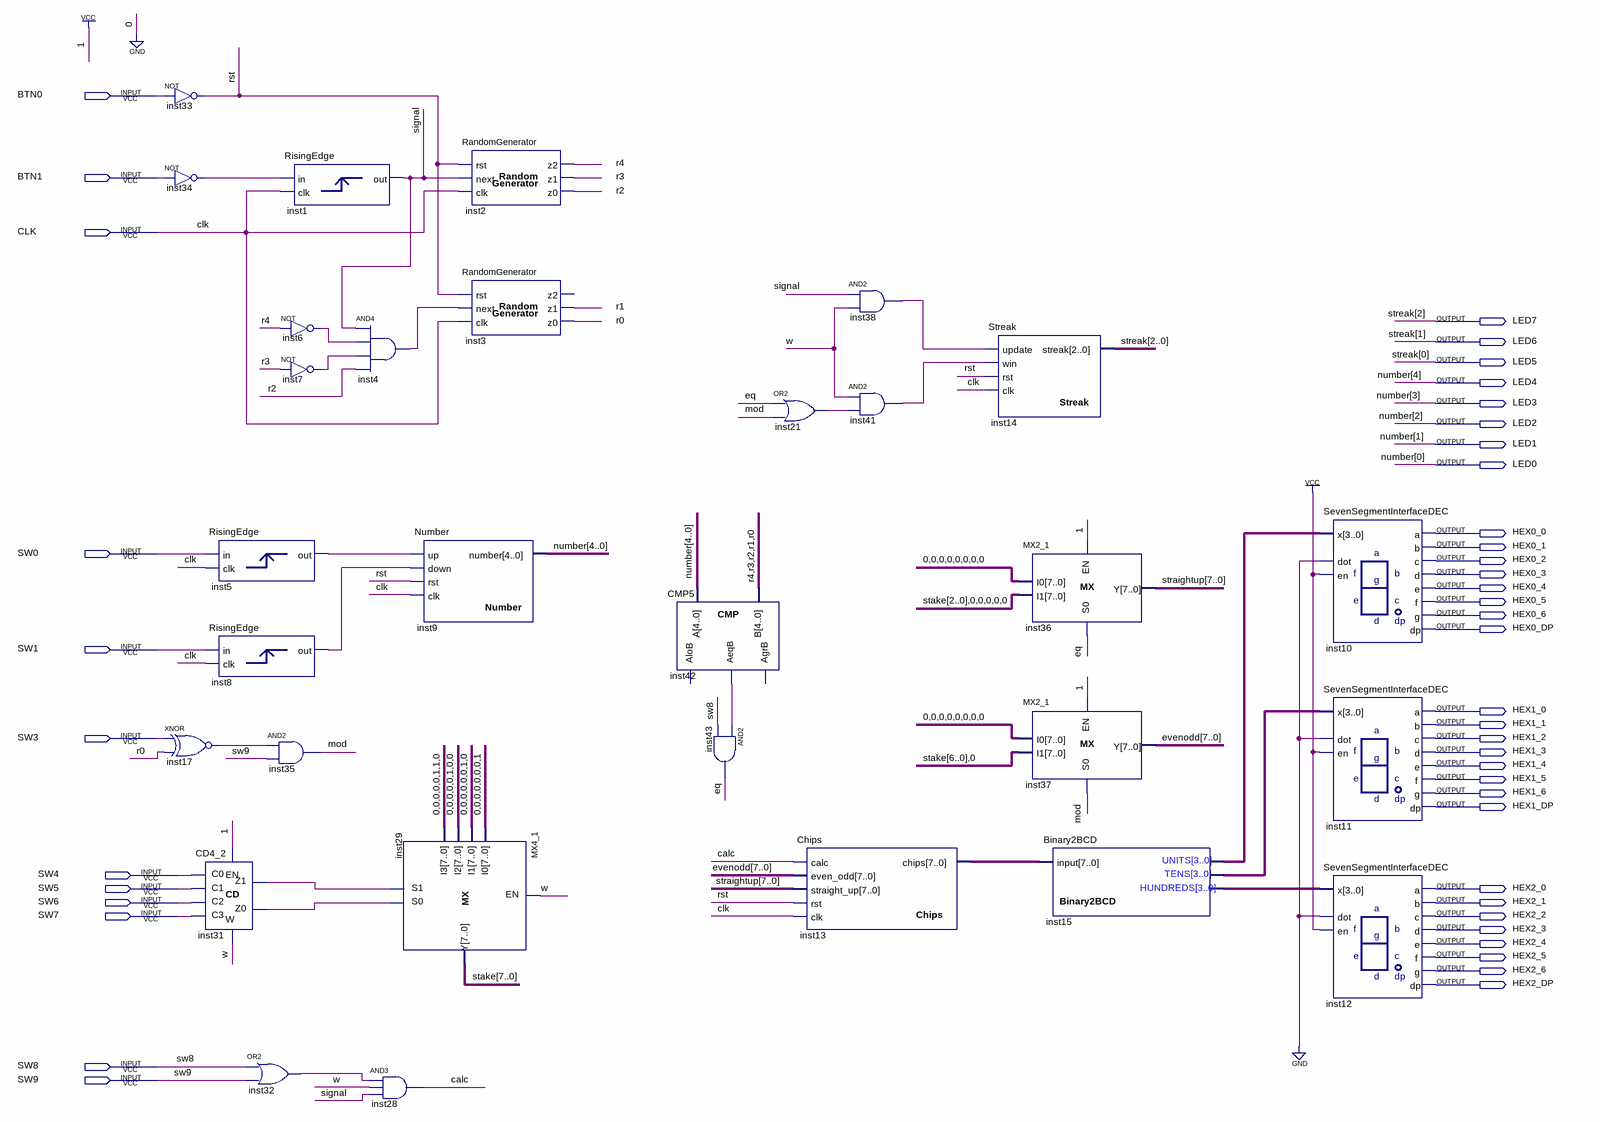
[diagram p0: schematic sheet]
// Quartus schematic PORT_LAB4.bdf as structural Verilog: 30 symbols, 44 pins
module PORT_LAB4 (
  input  BTN0,
  input  BTN1,
  input  CLK,
  input  SW0,
  input  SW1,
  input  SW3,
  input  SW4,
  input  SW5,
  input  SW6,
  input  SW7,
  input  SW8,
  input  SW9,
  output LED7,
  output LED6,
  output LED5,
  output LED4,
  output LED3,
  output LED2,
  output LED1,
  output LED0,
  output HEX0_0,
  output HEX0_1,
  output HEX0_2,
  output HEX0_3,
  output HEX0_4,
  output HEX0_5,
  output HEX0_6,
  output HEX0_DP,
  output HEX1_0,
  output HEX1_1,
  output HEX1_2,
  output HEX1_3,
  output HEX1_4,
  output HEX1_5,
  output HEX1_6,
  output HEX1_DP,
  output HEX2_0,
  output HEX2_1,
  output HEX2_2,
  output HEX2_3,
  output HEX2_4,
  output HEX2_5,
  output HEX2_6,
  output HEX2_DP
);

  wire calc, eq, inst4_out, inst5_output, inst6_out, inst7_out, inst8_output, inst17_out, inst21_out,
       inst31_z0, inst31_z1, inst32_out, inst34_out, inst38_out, inst41_out, inst42_aeqb, mod, r0, r1, r2,
       r3, r4, rst, signal, w;
  wire [3:0] inst15_bcd_hundreds, inst15_bcd_tens, inst15_bcd_units;
  wire [7:0] evenodd, inst13_chips, stake, straightup;

  not inst33 (rst, BTN0);
  not inst34 (inst34_out, BTN1);
  xnor inst17 (inst17_out, SW3, r0);
  RisingEdge inst5 (.clk(CLK), .\input (SW0), .\output (inst5_output));
  RisingEdge inst8 (.clk(CLK), .\input (SW1), .\output (inst8_output));
  CD4_2 inst31 (.C0(SW4), .C1(SW5), .C2(SW6), .C3(SW7), .EN(1'b1), .Z0(inst31_z0), .Z1(inst31_z1), .W(w));
  RisingEdge inst1 (.clk(CLK), .\input (inst34_out), .\output (signal));
  not inst6 (inst6_out, r4);
  not inst7 (inst7_out, r3);
  and inst35 (mod, inst17_out, SW9);
  or inst32 (inst32_out, SW8, SW9);
  and inst4 (inst4_out, signal, inst6_out, inst7_out, r2);
  MX4_1 inst29 (
    .I3(8'b00000110), .I2(8'b00000100), .I1(8'b00000010), .I0(8'b00000001), .S1(inst31_z1), .S0(inst31_z0),
    .EN(w), .Y(stake));
  and inst28 (calc, inst32_out, w, signal);
  Number inst9 (.up(inst5_output), .down(inst8_output), .rst(rst), .clk(CLK), .number({LED4, LED3, LED2, LED1, LED0}));
  RandomGenerator inst2 (.NXT(signal), .RST(rst), .CLK(CLK), .Z2(r4), .Z1(r3), .Z0(r2));
  RandomGenerator inst3 (.NXT(inst4_out), .RST(rst), .CLK(CLK), .Z1(r1), .Z0(r0));  // open: Z2
  CMP5 inst42 (.A({LED4, LED3, LED2, LED1, LED0}), .B({r4, r3, r2, r1, r0}), .AeqB(inst42_aeqb));  // open: AgrB, AloB
  and inst43 (eq, inst42_aeqb, SW8);
  or inst21 (inst21_out, eq, mod);
  Chips inst13 (.calc(calc), .even_odd(evenodd), .straight_up(straightup), .rst(rst), .clk(CLK), .chips(inst13_chips));
  and inst38 (inst38_out, signal, w);
  and inst41 (inst41_out, w, inst21_out);
  Streak inst14 (.update(inst38_out), .win(inst41_out), .rst(rst), .clk(CLK), .streak({LED7, LED6, LED5}));
  MX2_1 inst36 (.I1({stake[2:0], {5{1'b0}}}), .I0({8{1'b0}}), .S0(eq), .EN(1'b1), .Y(straightup));
  MX2_1 inst37 (.I1({stake[6:0], 1'b0}), .I0({8{1'b0}}), .S0(mod), .EN(1'b1), .Y(evenodd));
  Binary2BCD inst15 (
    .\input (inst13_chips), .bcd_hundreds(inst15_bcd_hundreds), .bcd_tens(inst15_bcd_tens),
    .bcd_units(inst15_bcd_units));
  SevenSegmentInterfaceDEC inst10 (
    .dot(1'b0), .en(1'b1), .x(inst15_bcd_units), .a(HEX0_0), .b(HEX0_1), .c(HEX0_2), .d(HEX0_3), .e(HEX0_4),
    .f(HEX0_5), .g(HEX0_6), .dp(HEX0_DP));
  SevenSegmentInterfaceDEC inst11 (
    .dot(1'b0), .en(1'b1), .x(inst15_bcd_tens), .a(HEX1_0), .b(HEX1_1), .c(HEX1_2), .d(HEX1_3), .e(HEX1_4),
    .f(HEX1_5), .g(HEX1_6), .dp(HEX1_DP));
  SevenSegmentInterfaceDEC inst12 (
    .dot(1'b0), .en(1'b1), .x(inst15_bcd_hundreds), .a(HEX2_0), .b(HEX2_1), .c(HEX2_2), .d(HEX2_3),
    .e(HEX2_4), .f(HEX2_5), .g(HEX2_6), .dp(HEX2_DP));

  // Other names for the same wires on the sheet: number[4:0] = {LED4, LED3, LED2, LED1, LED0};
  //   streak[2:0] = {LED7, LED6, LED5}
endmodule
